# EAGLE design WemosD1_Feeder (EAGLE 8.7.0)

## Sheet 1 of 2
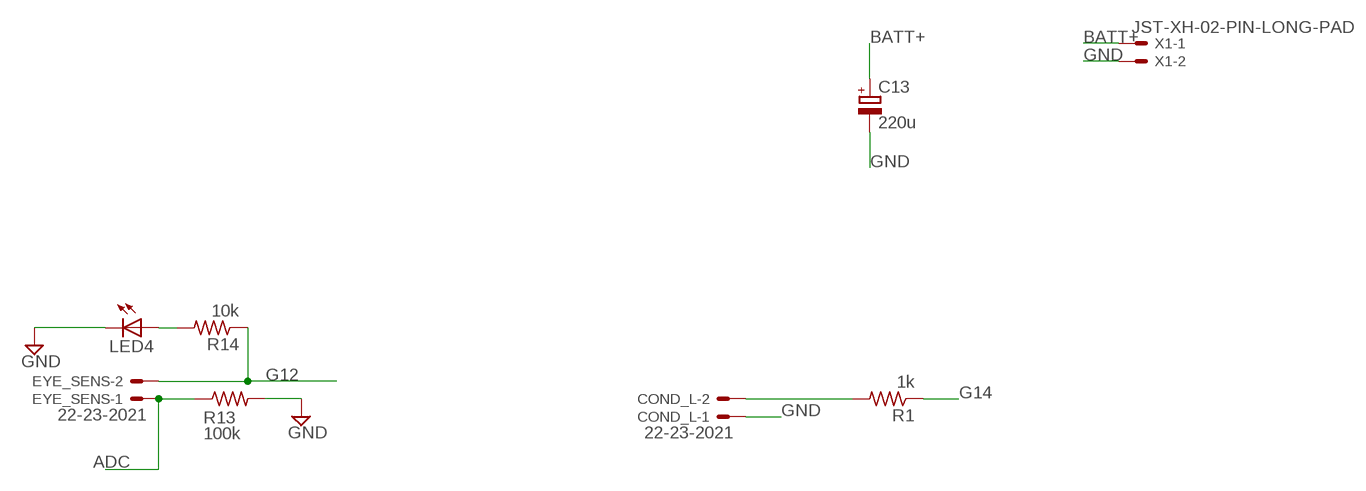
[diagram p0: schematic, sheet 1]

### Parts
C13  220u  CPOL-EUE2.5-7  [E2,5-7]
COND_L  22-23-2021  [22-23-2021]
EYE_SENS  22-23-2021  [22-23-2021]
LED4  LED5MM  [LED5MM]
R1  1k  R-US_R0603  [R0603]
R13  100k  R-US_R0603  [R0603]
R14  10k  R-US_R0603  [R0603]
X1  JST-XH-02-PIN-LONG-PAD  [JST-XH-02-PACKAGE-LONG-PAD]

### Nets
ADC: EYE_SENS.1 R13.1 ; also sheet 2
BATT+: C13.+ X1.1 ; also sheet 2
G12: EYE_SENS.2 R14.1 ; also sheet 2
G14: R1.1 ; also sheet 2
GND: C13.- COND_L.1 LED4.K(C) R13.2 X1.2 ; also sheet 2
N$2: COND_L.2 R1.2
N$33: LED4.A R14.2

## Sheet 2 of 2
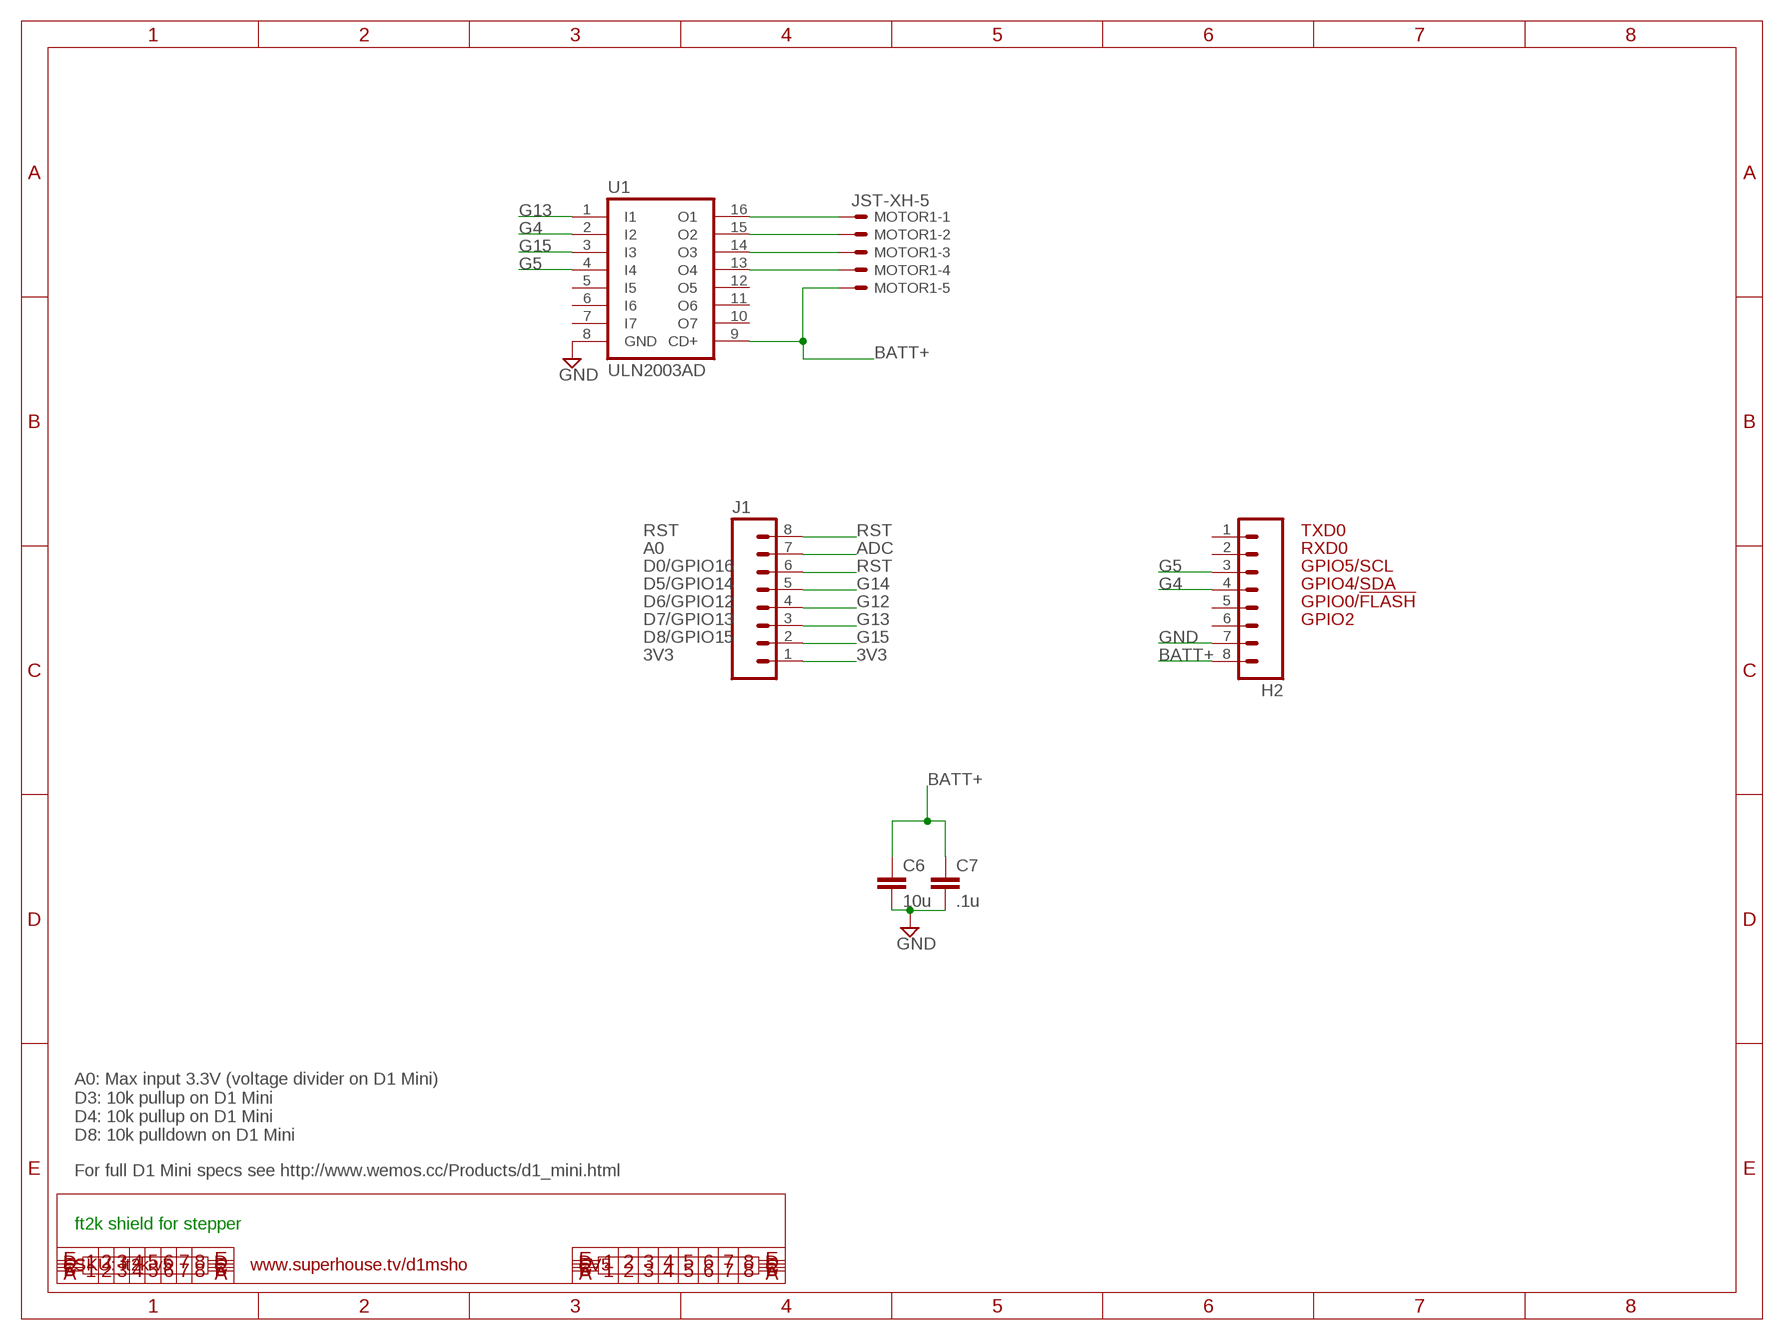
[diagram p1: schematic, sheet 2]

### Parts
C6  10u  C-EUC0603  [C0603]
C7  .1u  C-EUC0603  [C0603]
H2  M08  [1X08]
J1  M08  [1X08_ROUND]
MOTOR1  JST-XH-5  [JST-XH-5P]
U1  ULN2003AD  [SO16]

### Nets
3V3: J1.1
ADC: J1.7 ; also sheet 1
BATT+: C6.1 C7.1 H2.8 MOTOR1.P$5 U1.9(CD+) ; also sheet 1
G4: H2.4 U1.2(I2)
G5: H2.3 U1.4(I4)
G12: J1.4 ; also sheet 1
G13: J1.3 U1.1(I1)
G14: J1.5 ; also sheet 1
G15: J1.2 U1.3(I3)
GND: C6.2 C7.2 H2.7 U1.8(GND) ; also sheet 1
N$7: MOTOR1.P$1 U1.16(O1)
N$22: MOTOR1.P$2 U1.15(O2)
N$23: MOTOR1.P$3 U1.14(O3)
N$24: MOTOR1.P$4 U1.13(O4)
RST: J1.6 J1.8
Unconnected: H2.1 H2.2 H2.5 H2.6 U1.5(I5) U1.6(I6) U1.7(I7) U1.10(O7) U1.11(O6) U1.12(O5)

### Notes on the sheet
- RST | TXD0
- A0 | RXD0
- D0/GPIO16 | GPIO5/SCL
- D5/GPIO14 | GPIO4/SDA
- D6/GPIO12 | GPIO0/!FLASH
- D7/GPIO13 | GPIO2
- D8/GPIO15
- 3V3
- A0: Max input 3.3V (voltage divider on D1 Mini)
  D3: 10k pullup on D1 Mini
  D4: 10k pullup on D1 Mini
  D8: 10k pulldown on D1 Mini
- For full D1 Mini specs see http://www.wemos.cc/Products/d1_mini.html
- ft2k shield for stepper
- SKU: ft2k v5 | www.superhouse.tv/d1msho | V5

## Library data of the parts
C6 C7 = rcl:C-EU: CAPACITOR, European symbol
C13 = rcl:CPOL-EU: POLARIZED CAPACITOR, European symbol
COND_L EYE_SENS = con-molex:22-23-2021: .100" (2.54mm) Center Header - 2 Pin; MF: MOLEX; MPN: 22-23-2021; OC_FARNELL: 1462926; OC_NEWARK: 25C3832
H2 = freetronics-original:M08: Header 8 Standard 8-pin 0.1" header. Use with straight break away headers (SKU : PRT-00116), right angle break away headers (PRT-00553), swiss pins (PRT-00743), machine pins (PRT-00117), and female headers (PRT-00115).
J1 = SparkFun-Connectors:M08: Header 8 Standard 8-pin 0.1" header. Use with straight break away headers (SKU : PRT-00116), right angle break away headers (PRT-00553), swiss pins (PRT-00743), machine pins (PRT-00117), and female headers (PRT-00115).; PROD_ID: CONN-08437
LED4 = led:LED: LED OSRAM: - CHIPLED LG R971, LG N971, LY N971, LG Q971, LY Q971, LO R971, LY R971 LH N974, LH R974 LS Q976, LO Q976, LY Q976 LO Q996 - Hyper CHIPLED LW Q18S LB Q993, LB Q99A, LB R99A - SideLED LS A670, LO A670, LY A670, LG A670, LP A670 LB A673, LV A673, LT A673, LW A673 LH A674 LY A675 LS A676, LA A676, LO A676, LY A676, LW A676 LS A679, LY A679, LG A679 - Hyper Micro SIDELED® LS Y876, LA Y876, LO Y876, LY Y876 LT Y87S - SmartLED LW L88C, LW L88S LB L89C, LB L89S, LG L890 LS L89K, LO L89K, LY L89K LS L896, LA L896, LO L896, LY L896 - TOPLED LS T670, LO T670, LY T670, LG T670, LP T670 LSG T670, LSP T670, LSY T670, LOP T670, LYG T670 LG T671, LOG T671, LSG T671 LB T673, LV T673, LT T673, LW T673 LH T674 LS T676, LA T676, LO T676, LY T676, LB T676, LH T676, LSB T676, LW T676 LB T67C, LV T67C, LT T67C, LS T67K, LO T67K, LY T67K, LW E67C LS E67B, LA E67B, LO E67B, LY E67B, LB E67C, LV E67C, LT E67C LW T67C LS T679, LY T679, LG T679 LS T770, LO T770, LY T770, LG T770, LP T770 LB T773, LV T773, LT T773, LW T773 LH T774 LS E675, LA E675, LY E675, LS T675 LS T776, LA T776, LO T776, LY T776, LB T776 LHGB T686 LT T68C, LB T68C - Hyper Mini TOPLED® LB M676 - Mini TOPLED Santana® LG M470 LS M47K, LO M47K, LY M47K Source: http://www.osram.convergy.de LUXEON: - LUMILED® LXK2-PW12-R00, LXK2-PW12-S00, LXK2-PW14-U00, LXK2-PW14-V00 LXK2-PM12-R00, LXK2-PM12-S00, LXK2-PM14-U00 LXK2-PE12-Q00, LXK2-PE12-R00, LXK2-PE12-S00, LXK2-PE14-T00, LXK2-PE14-U00 LXK2-PB12-K00, LXK2-PB12-L00, LXK2-PB12-M00, LXK2-PB14-N00, LXK2-PB14-P00, LXK2-PB14-Q00 LXK2-PR12-L00, LXK2-PR12-M00, LXK2-PR14-Q00, LXK2-PR14-R00 LXK2-PD12-Q00, LXK2-PD12-R00, LXK2-PD12-S00 LXK2-PH12-R00, LXK2-PH12-S00 LXK2-PL12-P00, LXK2-PL12-Q00, LXK2-PL12-R00 Source: www.luxeon.com KINGBRIGHT: KA-3528ASYC Source: www.kingbright.com
MOTOR1 = con-JST:JST-XH-5
R1 R13 R14 = rcl:R-US_: RESISTOR, American symbol
U1 = uln-udn:ULN2003A: DRIVER ARRAY
X1 = Rembrandt Electronics - JST XH Connectors v1-0:JST-XH-02-PIN: JST XH Connector 2 Pin Wire to board connector. Pitch: 2,54 mm, (0.100") Number of pins: 2 Created by Rembrandt Electronics www.rembrandtelectronics.com

## Board
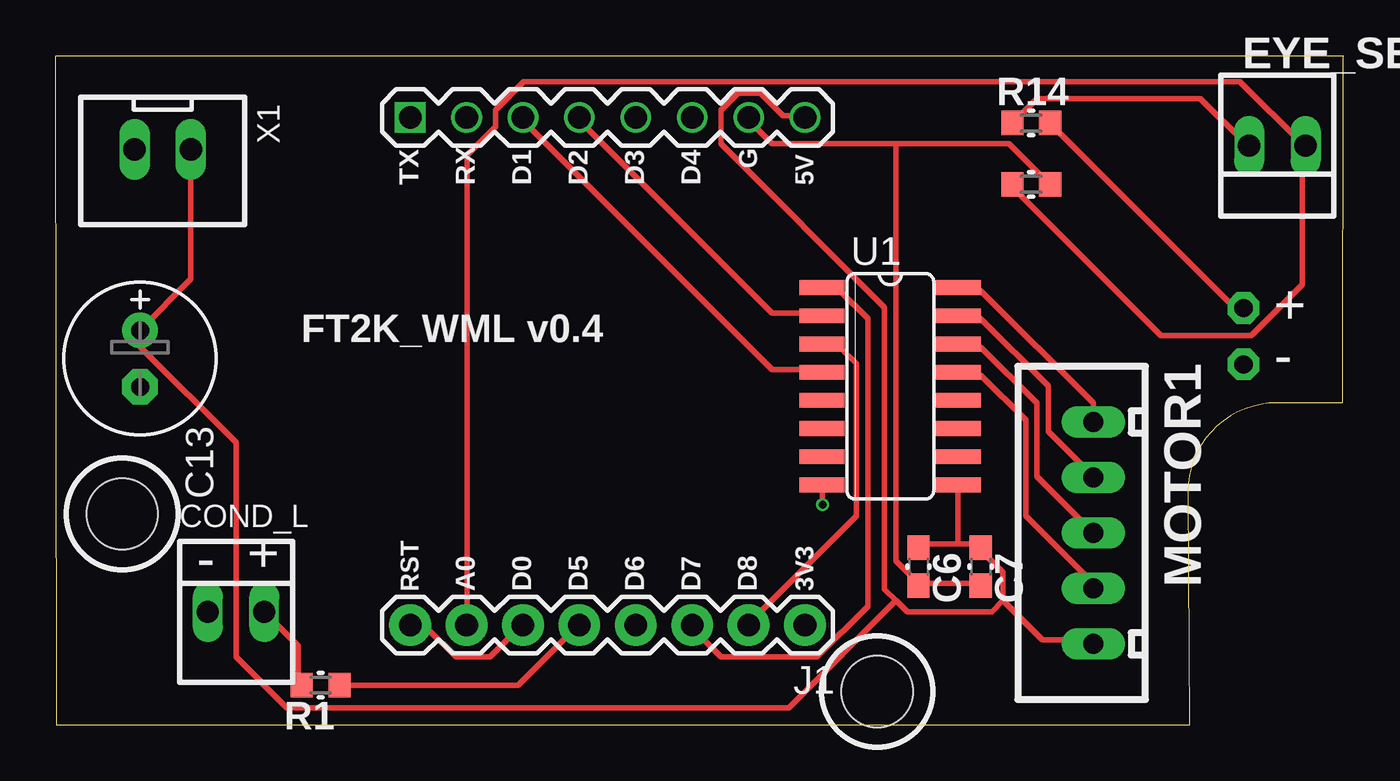
[diagram p2: board, top side]
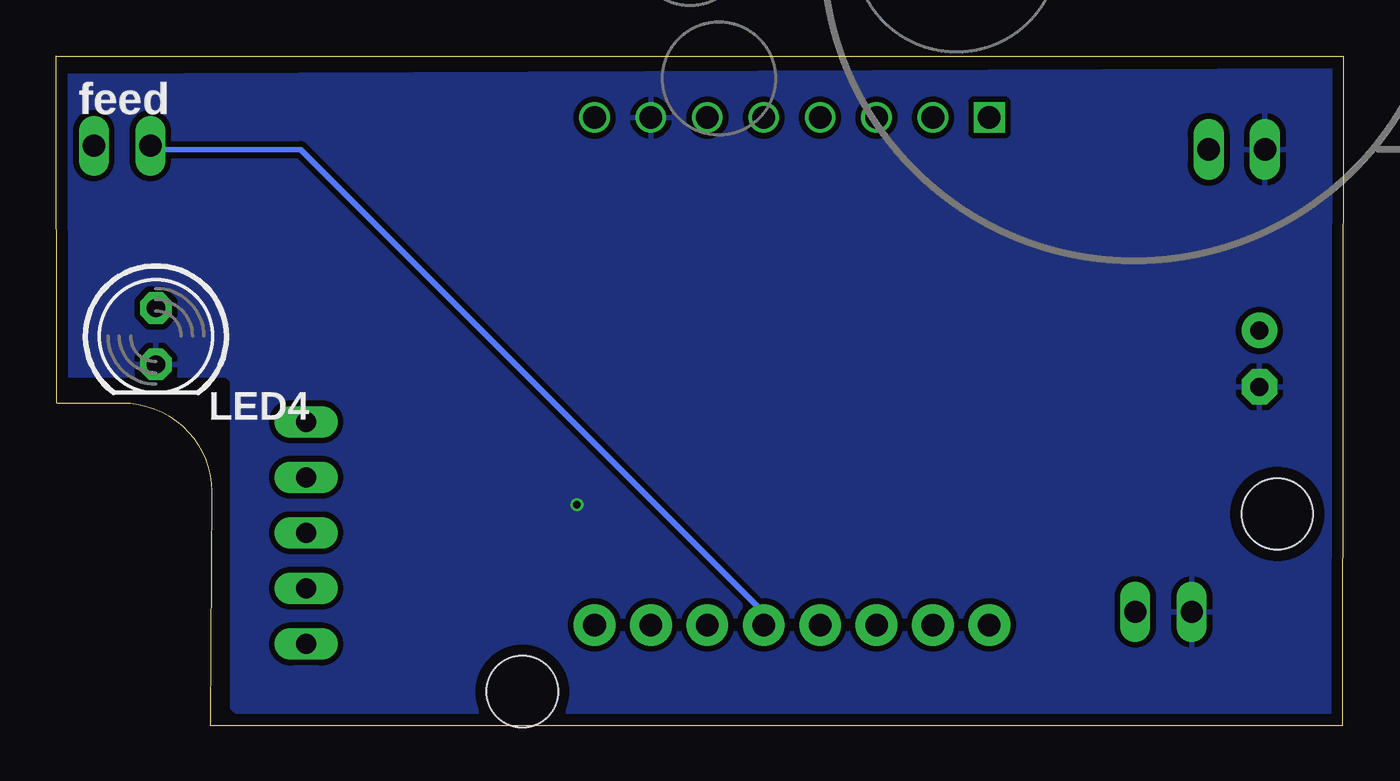
[diagram p3: board, bottom side, seen from below]

Size 58.02 x 30.16 mm. Coordinates in mm from the lower left corner, seen from the top.
Outline: 58.02,30.13 0,30.13 0.05,0 51.05,0 51,10.52 arc-90 55,14.52 57.97,14.52 58,30.16
Copper layers (1*16): Top 0.0356mm / dielectric 1.5011mm / Bottom 0.0356mm
Design rules "oshpark-2layer *": minimum track width 10mil, minimum drill 13mil, track to track 10mil, track to pad 10mil, pad to pad 10mil, via to via 10mil, smd to smd 10mil, copper to edge 20mil, drill to drill 6mil, minimum pad ring 6mil, minimum via ring 5mil, stop-mask expansion 1.5mil, vias tented up to drill 0mil, thermal gap 10mil
Holes 3.2 mm at 3,9.52 37,1.52

### Footprints (pad centres in the part's own frame; a part is rotated, then mirrored left to right if it is on the bottom)
C0603 = smd 1.1 x 1: 1 -0.85,0; 2 0.85,0
E2,5-7 = drill 0.813 pad 1.6: + -1.27,0 | drill 0.813 pad 1.6 octagon: - 1.27,0
22-23-2021 = drill 1 long: 1 -1.27,0; 2 1.27,0
1X08 = drill 1.016 square: 1 0,0 | drill 1.016: 2 2.54,0; 3 5.08,0; 4 7.62,0; 5 10.16,0; 6 12.7,0; 7 15.24,0; 8 17.78,0
1X08_ROUND = drill 1.016 pad 1.88: 1 0,0; 2 2.54,0; 3 5.08,0; 4 7.62,0; 5 10.16,0; 6 12.7,0; 7 15.24,0; 8 17.78,0
LED5MM = drill 0.813 pad 1.422 octagon: A -1.27,0; K 1.27,0
JST-XH-5P = drill 0.9 pad 1.422 long: P$1 -5,0; P$2 -2.5,0; P$3 0,0; P$4 2.5,0; P$5 5,0
R0603 = smd 1 x 1.1: 1 -0.85,0; 2 0.85,0
SO16 = smd 0.66 x 2.032: 1 -4.445,-3.073; 2 -3.175,-3.073; 3 -1.905,-3.073; 4 -0.635,-3.073; 5 0.635,-3.073; 6 1.905,-3.073; 7 3.175,-3.073; 8 4.445,-3.073; 9 4.445,3.073; 10 3.175,3.073; 11 1.905,3.073; 12 0.635,3.073; 13 -0.635,3.073; 14 -1.905,3.073; 15 -3.175,3.073; 16 -4.445,3.073
JST-XH-02-PACKAGE-LONG-PAD = drill 1.016 long: 1 -1.27,0; 2 1.27,0

### Placement (x,y rotation side)
C6  38.86,7.14 270 top
C7  41.66,7.14 270 top
C13  3.81,16.51 270 top
COND_L  8.13,5.11 0 top
EYE_SENS  55.02,26.1 180 top
H2  15.97,27.37 0 top
J1  33.75,4.51 180 top
LED4  53.5,17.52 270 bottom
MOTOR1  46.74,8.66 270 top
R1  11.94,1.8 180 top
R13  43.94,24.37 0 top
R14  43.94,27.12 0 top
U1  37.59,15.27 270 top
U$3  [FT2K_PLATE]  9.45,34.93 0 bottom  (outside the outline)
X1  4.83,25.93 180 top

### Tracks (layer width: path | path; a pad name or v marks a point on that pad's centre or on a via)
ADC
  Top 0.254: R13.1 43.18,24.16 49.78,17.55 53.85,17.55 56.13,19.84 56.13,25.93 EYE_SENS.1 56.13,26.19 53.34,28.98 21.08,28.98 19.81,27.71 19.81,26.95 18.54,25.68 18.54,4.6 J1.7
BATT+
  Top 0.254: X1.1 6.1,20.09 3.81,17.81 C13.+ 3.81,17.55 3.81,17.04 8.13,12.73 8.13,3.07 10.41,0.79 33.02,0.79 37.85,5.61 | 40.64,8.15 41.66,8.15 C7.1 41.66,7.9 42.67,6.88 42.67,5.61 | 40.64,8.15 38.86,8.15 C6.1 | 40.64,8.15 40.64,10.69 U1.9 | 37.85,5.61 38.35,5.11 42.16,5.11 42.67,5.61 | 37.85,5.61 37.34,6.12 37.34,18.82 29.97,26.19 29.97,27.71 30.73,28.47 31.75,28.47 32.77,27.46 33.53,27.46 H2.8 | 42.67,5.61 44.45,3.84 46.74,3.84 MOTOR1.P$5
G4
  Top 0.254: U1.2 34.29,18.57 32.26,18.57 23.62,27.2 H2.4
G5
  Top 0.254: U1.4 34.29,16.03 32.26,16.03 21.08,27.2 H2.3
G12
  Top 0.254: R14.1 43.18,27.2 44.2,28.22 51.56,28.22 53.59,26.19 EYE_SENS.2
  Bottom 0.254: J1.4 26.16,4.6 26.16,5.11 46.99,25.93 53.59,25.93 EYE_SENS.2
G13
  Top 0.254: U1.1 34.54,19.58 35.31,19.58 36.58,18.31 36.58,5.36 34.29,3.07 29.97,3.07 28.7,4.34 J1.3
G14
  Top 0.254: R1.1 20.83,1.8 23.37,4.34 J1.5
G15
  Top 0.254: U1.3 34.54,17.04 35.31,17.04 36.07,16.28 36.07,9.42 31.24,4.6 J1.2
GND  (via drill 0.33)
  Top 0.254: 38.86,6.38 41.66,6.38 C7.2 | 37.85,26.19 32.26,26.19 31.24,27.2 H2.7 | 37.85,26.19 42.93,26.19 44.7,24.41 R13.2 | 38.86,6.38 37.85,7.39 37.85,26.19 | 38.86,6.38 C6.2 | v34.54,9.93 34.54,10.69 U1.8
  pour Bottom: 0.76,0.53 49.78,0.53 50.04,0.79 50.04,15.52 50.29,15.77 57.4,15.77 57.4,22.89 57.66,23.14 57.66,25.17 57.4,29.24 0.51,29.49 0.51,0.79
N$2
  Top 0.254: COND_L.2 10.92,3.58 10.92,1.8 R1.2
N$7
  Top 0.254: MOTOR1.P$1 46.74,14.5 41.66,19.58 40.89,19.58 U1.16
N$22
  Top 0.254: U1.15 40.89,18.31 41.66,18.31 44.7,15.27 44.7,13.23 46.74,11.2 MOTOR1.P$2
N$23
  Top 0.254: MOTOR1.P$3 44.2,11.2 44.2,14.5 41.66,17.04 40.89,17.04 U1.14
N$24
  Top 0.254: U1.13 40.89,15.77 41.66,15.77 43.69,13.74 43.69,9.42 46.74,6.38 MOTOR1.P$4
N$33
  Top 0.254: R14.2 53.34,18.57 LED4.A
RST
  Top 0.254: J1.8 16,4.34 16.76,4.34 18.03,3.07 19.56,3.07 20.83,4.34 J1.6

### Text on the board
tPlace: G | TX | RX | D1 | D2 | D3 | D4 | 5V | + | - | - | + | RST | A0 | D0 | D5 | D6 | D7 | D8 | 3V3
tNames: FT2K_WML v0.4
bNames: feed